# Altium schematic sheet haptic_ring.SchDoc
size A4
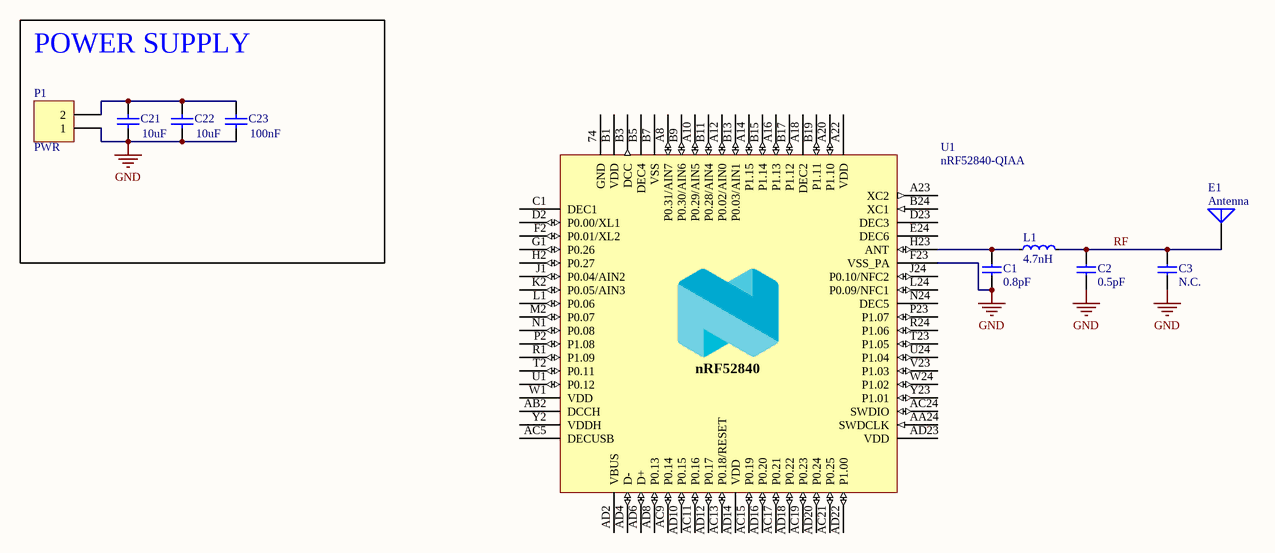
[diagram p0: haptic_ring.SchDoc]

## Parts
C1  0.8pF  [C_1005]
C2  0.5pF  [C_1005]
C3  N.C.  [C_1005]
C21  value 10uF  [C_0402]  (hidden comment: Cap Semi)
C22  value 10uF  [C_0402]  (hidden comment: Cap Semi)
C23  value 100nF  [C_0402]  (hidden comment: Cap Semi)
E1  Antenna  [2450AT18B100]
L1  4.7nH  [L_1005]
P1  PWR  [HDR1X2]
U1  nRF52840-QIAA  [AQFN50P700X700X85_HS-74N]

## Blocks framed on the sheet
POWER SUPPLY: C21-C23 P1

## Nets
GND: C1.1 C2.1 C3.2 C21.1 C22.1 C23.1 P1.1 U1.F23(VSS_PA)
RF: C2.2 C3.1 E1.1(A) L1.2
NetC1_2: C1.2 L1.1 U1.H23(ANT)
NetC21_2: C21.2 C22.2 C23.2 P1.2

Not connected (* = marked no-connect by the designer): U1 74(GND) A8(P0.31/AIN7) A10(P0.29/AIN5) A12(P0.02/AIN0) A14(P1.15) A16(P1.13) A18(DEC2) A20(P1.10) A22(VDD) A23(XC2) AA24(SWDCLK) AB2(DCCH) AC5(DECUSB) AC9(P0.14) AC11(P0.16) AC13(P0.18/RESET) AC15(P0.19) AC17(P0.21) AC19(P0.23) AC21(P0.25) AC24(SWDIO) AD2(VBUS) AD4(D-) AD6(D+) AD8(P0.13) AD10(P0.15) AD12(P0.17) AD14(VDD) AD16(P0.20) AD18(P0.22) AD20(P0.24) AD22(P1.00) AD23(VDD) B1(VDD) B3(DCC) B5(DEC4) B7(VSS) B9(P0.30/AIN6) B11(P0.28/AIN4) B13(P0.03/AIN1) B15(P1.14) B17(P1.12) B19(P1.11) B24(XC1) C1(DEC1) D2(P0.00/XL1) D23(DEC3) E24(DEC6) F2(P0.01/XL2) G1(P0.26) H2(P0.27) J1(P0.04/AIN2) J24(P0.10/NFC2) K2(P0.05/AIN3) L1(P0.06) L24(P0.09/NFC1) M2(P0.07) N1(P0.08) N24(DEC5) P2(P1.08) P23(P1.07) R1(P1.09) R24(P1.06) T2(P0.11) T23(P1.05) U1(P0.12) U24(P1.04) V23(P1.03) W1(VDD) W24(P1.02) Y2(VDDH) Y23(P1.01)

## Notes on the sheet
- (in symbol nRF52840-QIAA) nRF52840

## Library data of the parts
C1 = C0402-0.8p: Capacitor, NP0, ±10%; Pad Count: 2; Part Number: C0402-0.8p; LatestRevisionDate: 2012-11-21; Published: 2009-05-08; Value: 0.8pF; Footprint Doc: 0402
C2 = C0402-0.5p: Capacitor, NP0, ±10%; Pad Count: 2; Part Number: C0402-0.5p; LatestRevisionDate: 2017-02-23; Published: 2009-05-08; Value: 0.5pF; Footprint Doc: 0402
C3 = C0402-N.C.: Not mounted; Pad Count: 2; Assembly: Not mounted; Part Number: C0402-N.C.; LatestRevisionDate: 2009-05-08; Published: 2009-05-08; Value: N.C.; Footprint Doc: 0402
C21-C23 = Cap Semi: Capacitor (Semiconductor SIM Model); Published: 8-Jun-2000; LatestRevisionDate: 29-May-2009; LatestRevisionNote: IPC-7351 Footprint Added.; PackageReference: C1206; Publisher: Altium Limited; PackageDescription: Chip Capacitor
E1 = Antenna: Generic Antenna; Published: 24-Mar-1999; LatestRevisionDate: 17-Jul-2002; LatestRevisionNote: Re-released for DXP Platform.; PackageReference: PIN1; Publisher: Altium Limited
L1 = L0402-4n7: High frequency chip inductor ±5%; Pad Count: 2; Part Number: L0402-4n7; LatestRevisionDate: 2012-09-19; Published: 2009-05-08; Value: 4.7nH; Footprint Doc: 0402
P1 = Header 2: Header, 2-Pin; LatestRevisionDate: 17-Jul-2002; LatestRevisionNote: Re-released for DXP Platform.; Publisher: Altium Limited
U1 = nRF52840-QIAA: Multi-protocol Bluetooth Low Energy, IEEE 802.15.4, ANT and 2.4GHz proprietary system-on-chip; Pad Count: 73; Part Number: nRF52840-QIAA; LatestRevisionDate: 2017-08-21; Published: 2017-08-21; Value: nRF52840-QIAA; Footprint Doc: AQFN-73